# EAGLE design LCD_breakout (EAGLE 7.2.0)
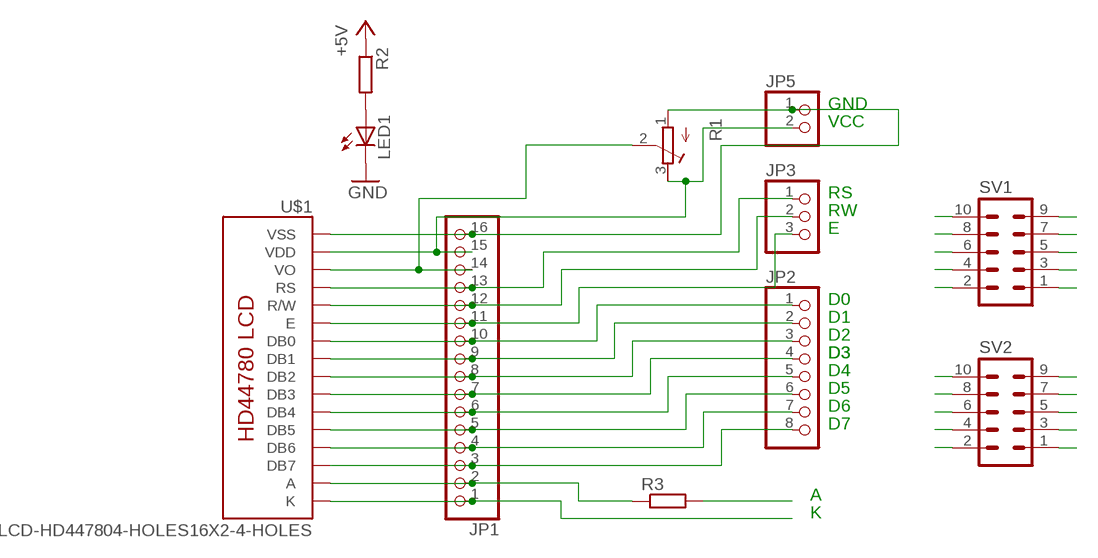
[diagram p0: schematic, sheet 1]

## Parts
JP1  PINHD-1X16  [1X16]
JP2  PINHD-1X8  [1X08]
JP3  PINHD-1X3  [1X03]
JP5  PINHD-1X2  [1X02]
LED1  LED3MM  [LED3MM]
R1  R-TRIMM3339P  [RTRIM3339P]
R2  R-EU_0204/5  [0204/5]
R3  R-EU_0204/5  [0204/5]
SV1  ML10  [ML10]
SV2  ML10  [ML10]
U$1  LCD-HD447804-HOLES16X2-4-HOLES  [LCD-16X2-4HOLES]

## Nets
+5V: JP1.15 JP5.2 R1.3(A) R2.1 R3.2 SV1.9 SV2.9 U$1.2(VDD)
D0: JP1.10 JP2.1 SV2.1 U$1.7(DB0)
D1: JP1.9 JP2.2 SV2.2 U$1.8(DB1)
D2: JP1.8 JP2.3 SV2.3 U$1.9(DB2)
D3: JP1.7 JP2.4 SV2.4 U$1.10(DB3)
D4: JP1.6 JP2.5 SV2.5 U$1.11(DB4)
D5: JP1.5 JP2.6 SV2.6 U$1.12(DB5)
D6: JP1.4 JP2.7 SV2.7 U$1.13(DB6)
D7: JP1.3 JP2.8 SV2.8 U$1.14(DB7)
EN: JP1.11 JP3.3 SV1.3 U$1.6(E)
GND: JP1.1 JP1.16 JP5.1 LED1.K(C) R1.1(E) SV1.10 SV2.10 U$1.1(VSS) U$1.16(K)
N$1: JP1.14 R1.2(S) U$1.3(VO)
N$2: LED1.A R2.2
N$5: SV1.8
N$18: JP1.2 R3.1 U$1.15(A)
N$20: SV1.6
N$21: SV1.4
N$35: SV1.5
N$36: SV1.7
RS: JP1.13 JP3.1 SV1.1 U$1.4(RS)
RW: JP1.12 JP3.2 SV1.2 U$1.5(R/W)

## Notes on the sheet
- GND
- VCC
- RS
- RW
- E
- D0
- D1
- D2
- D3 | D3
- D4
- D5
- D6
- D7
- A
- K

## Library data of the parts
JP1 = pinhead:PINHD-1X16: PIN HEADER
JP2 = pinhead:PINHD-1X8: PIN HEADER
JP3 = pinhead:PINHD-1X3: PIN HEADER
JP5 = pinhead:PINHD-1X2: PIN HEADER
LED1 = led:LED: LED OSRAM: - CHIPLED LG R971, LG N971, LY N971, LG Q971, LY Q971, LO R971, LY R971 LH N974, LH R974 LS Q976, LO Q976, LY Q976 LO Q996 - Hyper CHIPLED LW Q18S LB Q993, LB Q99A, LB R99A - SideLED LS A670, LO A670, LY A670, LG A670, LP A670 LB A673, LV A673, LT A673, LW A673 LH A674 LY A675 LS A676, LA A676, LO A676, LY A676, LW A676 LS A679, LY A679, LG A679 - Hyper Micro SIDELED® LS Y876, LA Y876, LO Y876, LY Y876 LT Y87S - SmartLED LW L88C, LW L88S LB L89C, LB L89S, LG L890 LS L89K, LO L89K, LY L89K LS L896, LA L896, LO L896, LY L896 - TOPLED LS T670, LO T670, LY T670, LG T670, LP T670 LSG T670, LSP T670, LSY T670, LOP T670, LYG T670 LG T671, LOG T671, LSG T671 LB T673, LV T673, LT T673, LW T673 LH T674 LS T676, LA T676, LO T676, LY T676, LB T676, LH T676, LSB T676, LW T676 LB T67C, LV T67C, LT T67C, LS T67K, LO T67K, LY T67K, LW E67C LS E67B, LA E67B, LO E67B, LY E67B, LB E67C, LV E67C, LT E67C LW T67C LS T679, LY T679, LG T679 LS T770, LO T770, LY T770, LG T770, LP T770 LB T773, LV T773, LT T773, LW T773 LH T774 LS E675, LA E675, LY E675, LS T675 LS T776, LA T776, LO T776, LY T776, LB T776 LHGB T686 LT T68C, LB T68C - Hyper Mini TOPLED® LB M676 - Mini TOPLED Santana® LG M470 LS M47K, LO M47K, LY M47K Source: http://www.osram.convergy.de LUXEON: - LUMILED® LXK2-PW12-R00, LXK2-PW12-S00, LXK2-PW14-U00, LXK2-PW14-V00 LXK2-PM12-R00, LXK2-PM12-S00, LXK2-PM14-U00 LXK2-PE12-Q00, LXK2-PE12-R00, LXK2-PE12-S00, LXK2-PE14-T00, LXK2-PE14-U00 LXK2-PB12-K00, LXK2-PB12-L00, LXK2-PB12-M00, LXK2-PB14-N00, LXK2-PB14-P00, LXK2-PB14-Q00 LXK2-PR12-L00, LXK2-PR12-M00, LXK2-PR14-Q00, LXK2-PR14-R00 LXK2-PD12-Q00, LXK2-PD12-R00, LXK2-PD12-S00 LXK2-PH12-R00, LXK2-PH12-S00 LXK2-PL12-P00, LXK2-PL12-Q00, LXK2-PL12-R00 Source: www.luxeon.com KINGBRIGHT: KA-3528ASYC Source: www.kingbright.com
R1 = resistor:R-TRIMM: Trimm resistor
R2 R3 = rcl:R-EU_: RESISTOR, European symbol
SV1 SV2 = con-harting-ml:ML10: HARTING; OC_FARNELL: unknown; OC_NEWARK: unknown
U$1 = HD44780LCD:LCD-HD44780

## Board
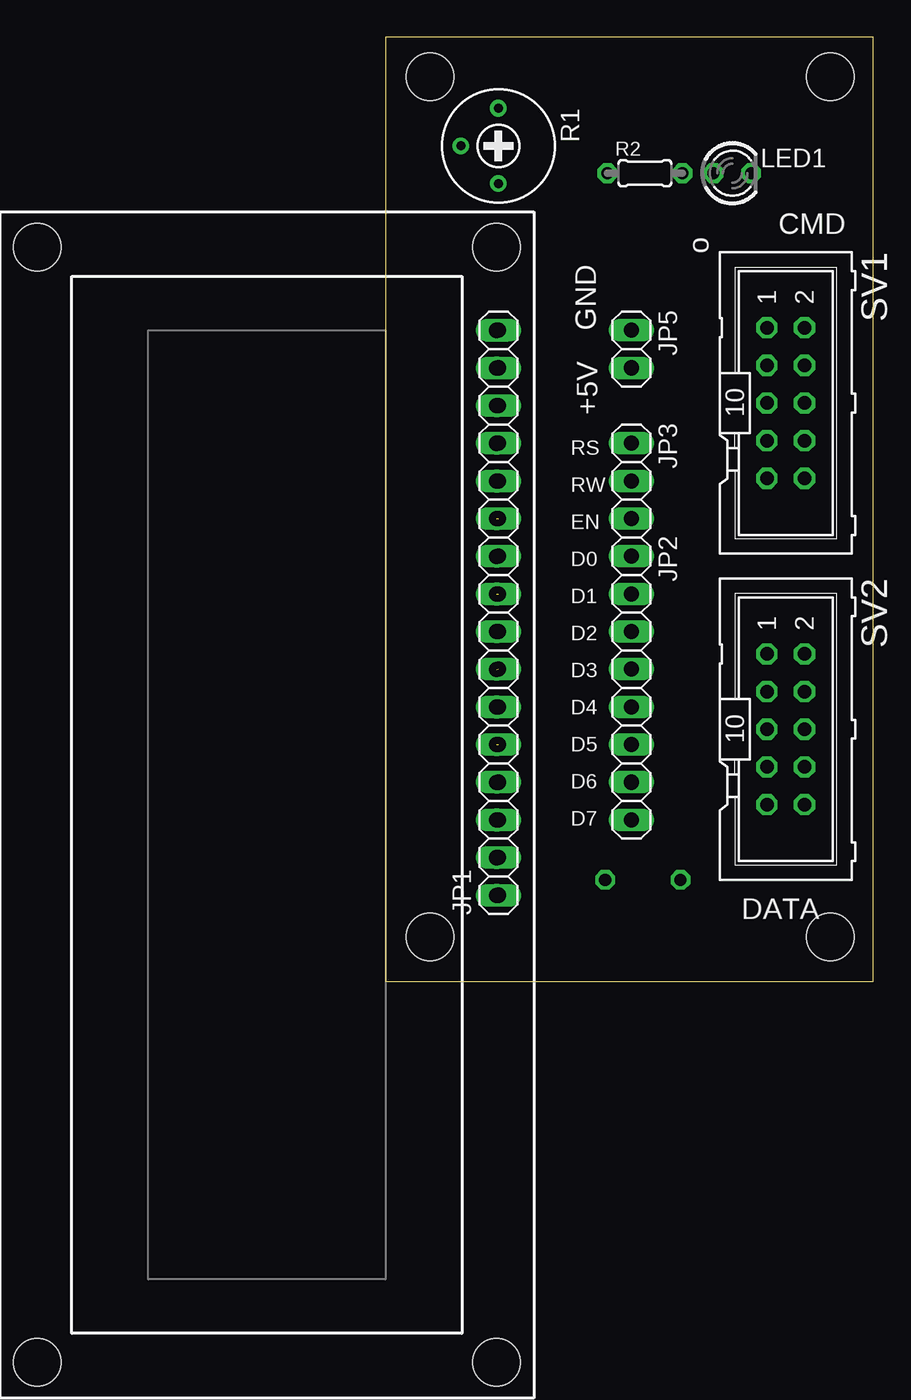
[diagram p1: board, top side]
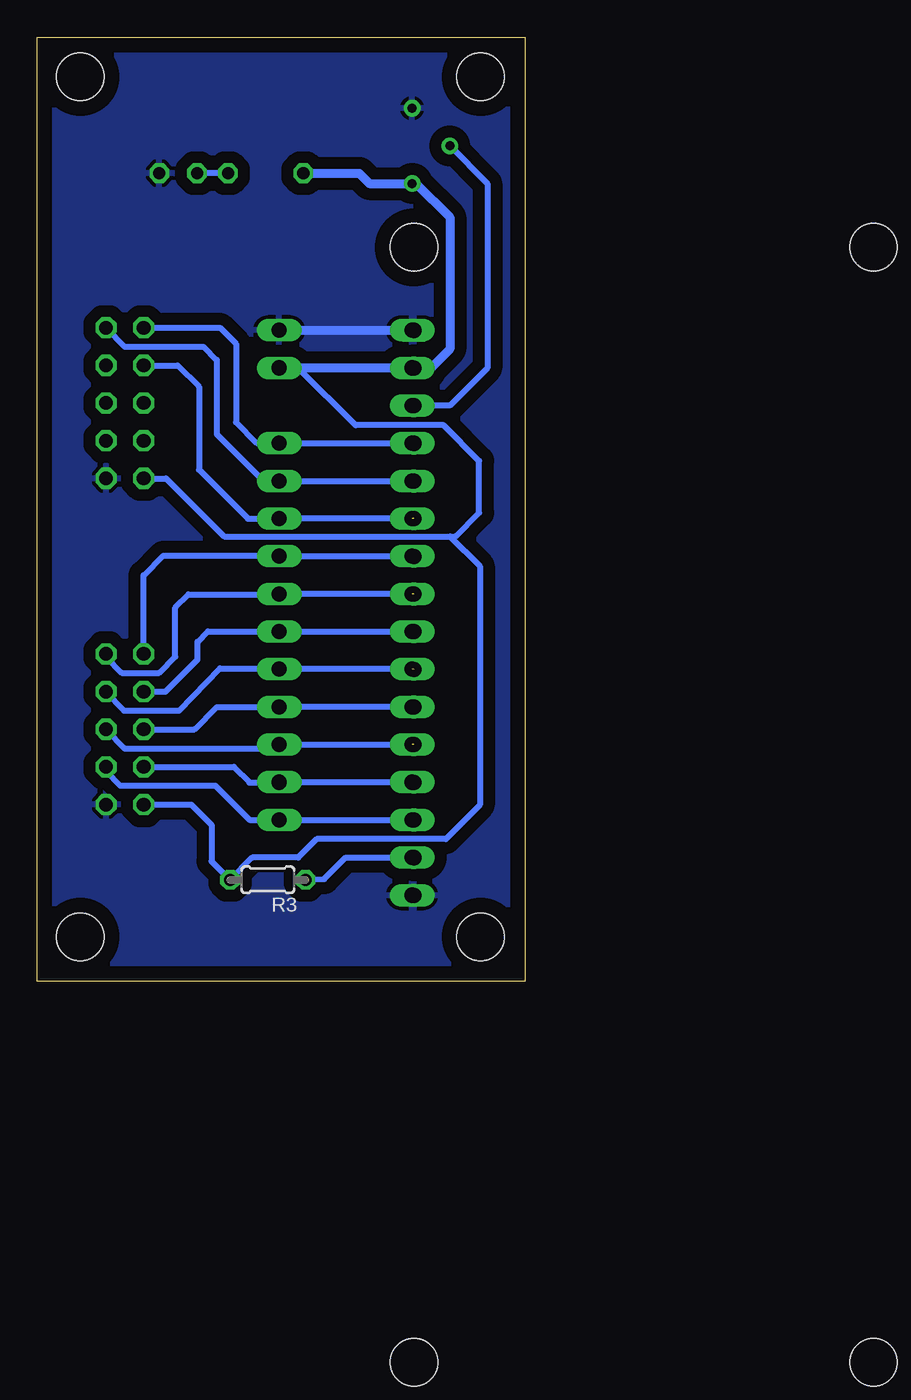
[diagram p2: board, bottom side, seen from below]

Size 32.92 x 63.68 mm. Coordinates in mm from the lower left corner, seen from the top.
Outline: 0,0 32.92,0 32.92,63.68 0,63.68 0,0
Copper layers (1*16): Top 0.035mm / dielectric 1.5mm / Bottom 0.035mm
Design rules "default": minimum track width 10mil, minimum drill 24mil, track to track 8mil, track to pad 8mil, pad to pad 8mil, via to via 8mil, smd to smd 8mil, copper to edge 40mil, drill to drill 8mil, minimum pad ring 10mil, minimum via ring 8mil, stop-mask expansion 4mil, vias tented up to drill 0mil, thermal gap 10mil
Holes 3.2 mm at 3,61 30,61 3,3 30,3

### Footprints (pad centres in the part's own frame; a part is rotated, then mirrored left to right if it is on the bottom)
1X16 = drill 1.016 long: 1 -19.05,0; 2 -16.51,0; 3 -13.97,0; 4 -11.43,0; 5 -8.89,0; 6 -6.35,0; 7 -3.81,0; 8 -1.27,0; 9 1.27,0; 10 3.81,0; 11 6.35,0; 12 8.89,0; 13 11.43,0; 14 13.97,0; 15 16.51,0; 16 19.05,0
1X08 = drill 1.016 long: 1 -8.89,0; 2 -6.35,0; 3 -3.81,0; 4 -1.27,0; 5 1.27,0; 6 3.81,0; 7 6.35,0; 8 8.89,0
1X03 = drill 1.016 long: 1 -2.54,0; 2 0,0; 3 2.54,0
1X02 = drill 1.016 long: 1 -1.27,0; 2 1.27,0
LED3MM = drill 0.813 octagon: A -1.27,0; K 1.27,0
RTRIM3339P = drill 0.61: 1 -2.54,0; 2 0,-2.54; 3 2.54,0
0204/5 = drill 0.813 octagon: 1 -2.54,0; 2 2.54,0
ML10 = drill 0.914 octagon: 1 -5.08,-1.27; 2 -5.08,1.27; 3 -2.54,-1.27; 4 -2.54,1.27; 5 0,-1.27; 6 0,1.27; 7 2.54,-1.27; 8 2.54,1.27; 9 5.08,-1.27; 10 5.08,1.27
LCD-16X2-4HOLES = drill 1.016 square: 1 -32,15.5 | drill 1.016: 2 -29.46,15.5; 3 -26.92,15.5; 4 -24.38,15.5; 5 -21.84,15.5; 6 -19.3,15.5; 7 -16.76,15.5; 8 -14.22,15.5; 9 -11.68,15.5; 10 -9.14,15.5; 11 -6.6,15.5; 12 -4.06,15.5; 13 -1.52,15.5; 14 1.02,15.5; 15 3.56,15.5; 16 6.1,15.5 | hole 3.2: -37.6,15.5; -37.6,-15.5; 37.6,-15.5; 37.6,15.5

### Placement (x,y rotation side)
JP1  7.62,24.86 90 top
JP2  16.59,19.78 270 top
JP3  16.59,33.75 270 top
JP5  16.59,42.64 270 top
LED1  23.4,54.5 0 top
R1  7.62,56.34 270 top
R2  17.5,54.5 0 top
R3  17.36,6.85 180 bottom
SV1  27,39 270 top
SV2  27,17 270 top
U$1  -8,11.9 270 top

### Tracks (layer width: path | path; a pad name or v marks a point on that pad's centre or on a via)
+5V
  Bottom 0.406: 6.35,41.37 JP1.15 U$1.2 | 15.3,41.37 11.43,37.5 5.5,37.5 3.1,35.1 3.1,31.6 4.7,30 5.05,30 | SV1.9 24.22,33.92 20.3,30 5.05,30 | SV2.9 22.52,11.92 21.15,10.55 21.15,8.1 R3.2 18.4,8.35 15.3,8.35 14.05,9.6 5.35,9.6 3.05,11.9 3.05,28 5.05,30
  Bottom 0.61: 6.35,41.37 5.08,42.64 5.08,51.53 7.35,53.8 R1.3 10.5,53.8 11.2,54.5 R2.1 | JP1.15 15.3,41.37 JP5.2
D0
  Bottom 0.406: U$1.7 JP1.10 JP2.1 16.62,28.7 24.4,28.7 25.73,27.37 SV2.1
D1  (1 unrouted)
  Bottom 0.406: JP1.9 JP2.2 16.62,26.1 22.7,26.1 23.6,25.2 23.6,21.9 24.7,20.8 27.2,20.8 28.27,21.87 SV2.2
D2
  Bottom 0.406: U$1.9 JP1.8 JP2.3 21.4,23.6 22.1,22.9 22.1,21.7 24.26,19.54 SV2.3
D3  (1 unrouted)
  Bottom 0.406: JP1.7 JP2.4 16.64,21.1 20.6,21.1 23.35,18.25 27.05,18.25 28.29,19.54 SV2.4
D4
  Bottom 0.406: U$1.11 JP1.6 JP2.5 20.8,18.5 22.3,17 SV2.5
D5  (1 unrouted)
  Bottom 0.406: JP1.5 JP2.6 16.86,15.7 27,15.7 28.27,16.97 SV2.6
D6
  Bottom 0.406: 8.2,13.43 JP2.7 16.62,13.4 18.6,13.4 19.66,14.46 SV2.7 | 8.2,13.43 JP1.4 | U$1.13 8.19,13.42 8.2,13.43
D7
  Bottom 0.406: U$1.14 JP1.3 JP2.8 18.6,10.9 20.9,13.2 27.3,13.2 28.27,14.17 SV2.8
EN  (1 unrouted)
  Bottom 0.406: JP1.11 JP3.3 18.7,31.2 22,34.5 22,40.1 23.44,41.54 SV1.3
GND
  Bottom 0.406: JP1.16 8.09,43.91 8.2,43.8 | JP1.1 8.2,5.81 8.19,5.8 U$1.16
  Bottom 0.61: JP5.1 JP1.16
  pour Bottom (isolate 0.813): 0,0 33,0 33,63.5 0,63.5
N$1
  Bottom 0.406: 6.3,38.83 5.08,38.83 2.54,41.37 2.54,53.8 R1.2 | 6.3,38.83 JP1.14 | U$1.3 6.29,38.82 6.3,38.83
N$2
  Bottom 0.406: R2.2 LED1.A
N$18
  Bottom 0.406: U$1.15 JP1.2 12.1,8.35 13.55,6.9 R3.1
RS
  Bottom 0.406: U$1.4 JP1.13 JP3.1 18.1,36.3 19.5,37.7 19.5,43 20.58,44.08 SV1.1
RW
  Bottom 0.406: U$1.5 JP1.12 JP3.2 16.64,33.7 17.6,33.7 20.8,36.9 20.8,41.9 21.7,42.8 27,42.8 SV1.2

### Text on the board
tNames: CMD | o | GND | +5V | RS | RW | EN | D0 | D1 | D2 | D3 | D4 | D5 | D6 | D7 | DATA